# EasyEDA schematic easyeda-no-connect.json
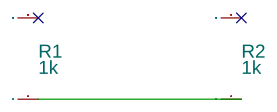
[diagram p0: schematic sheet]

## Parts
R1  1k  [X]
R2  1k  [X]

## Nets
Net-(R1-1): R1.1 R2.1

Not connected (* = marked no-connect by the designer): R1 2*; R2 2*
